# Altium schematic sheet 30to50V-24V_10A_1.SchDoc
size 279 x 215 mm; SheetNumber: 1; SheetTotal: 1
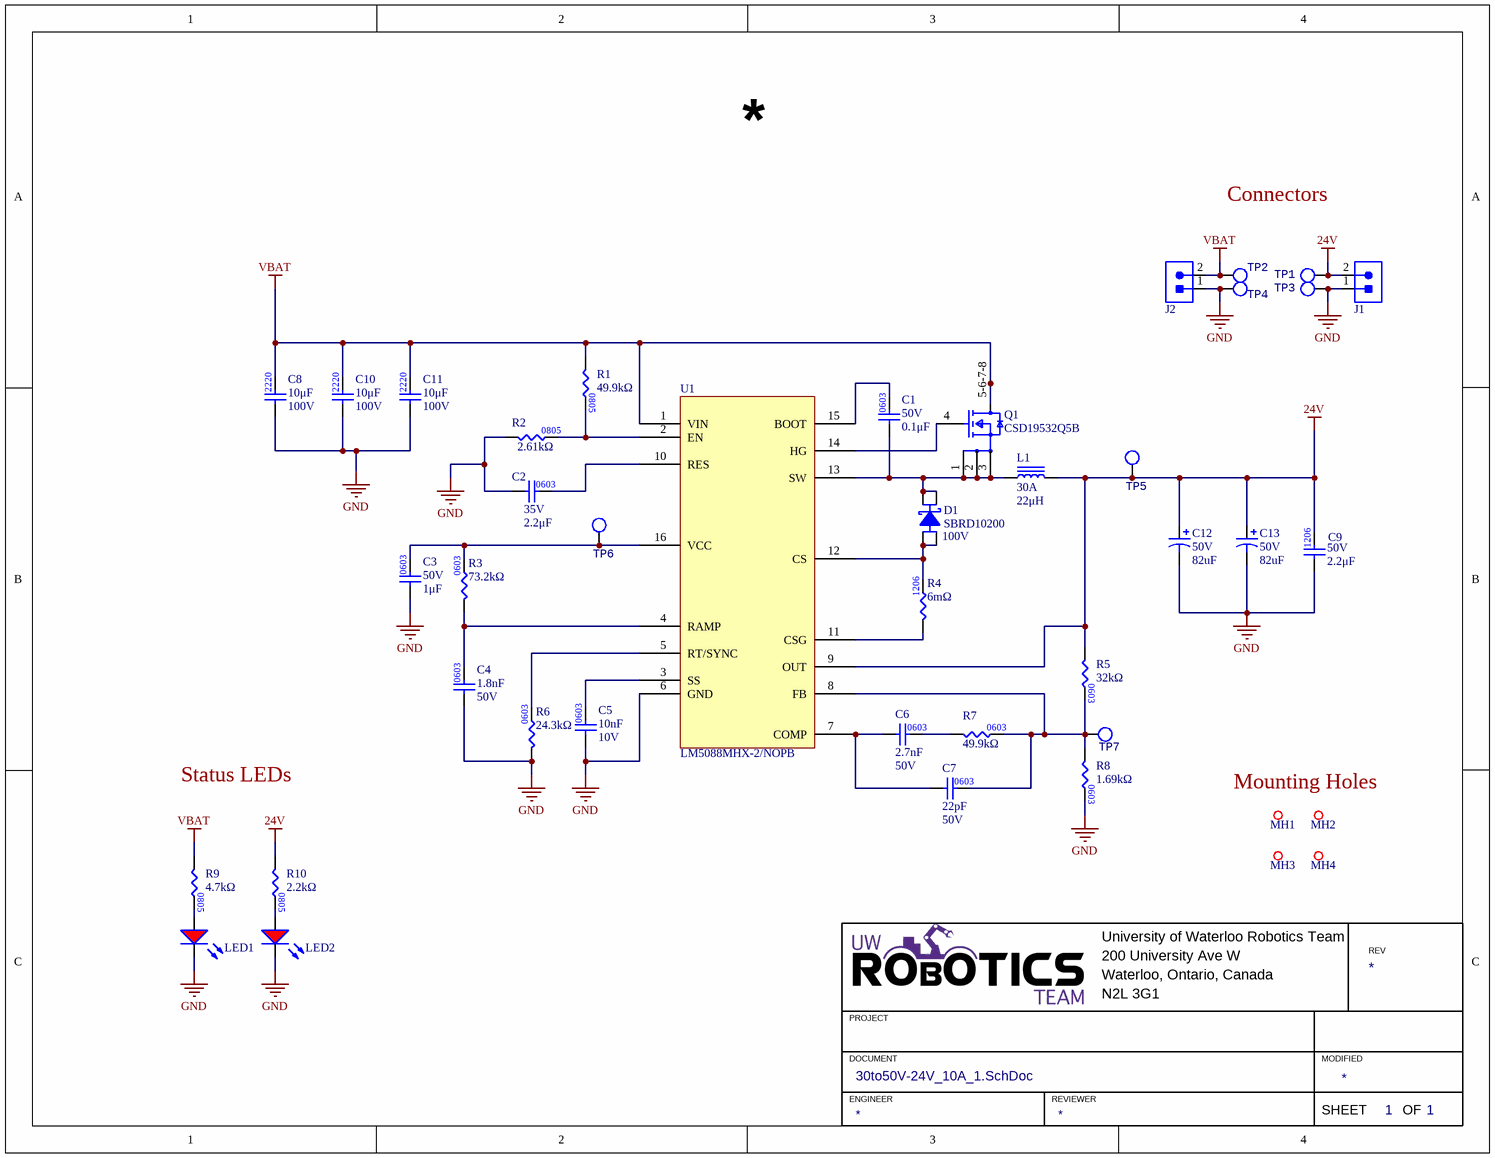
[diagram p0: 30to50V-24V_10A_1.SchDoc]

## Parts
C1  value 0.1μF  Voltage Rating: 50V  [CAP0603]  (hidden comment: CAP_0.1uF_50V_0603)
C2  value 2.2μF  Voltage Rating: 35V  [CAP0603]  (hidden comment: CAP_2.2uF_35V_0603)
C3  value 1μF  Voltage Rating: 50V  [CAP0603]  (hidden comment: CAP_1uF_50V_0603)
C4  value 1.8nF  Voltage Rating: 50V  [CAP0603]  (hidden comment: CAP_1.8nF_50V_0603)
C5  value 10nF  Voltage Rating: 10V  [CAP0603]  (hidden comment: CAP_10nF_25V_0603)
C6  value 2.7nF  Voltage Rating: 50V  [CAP0603]  (hidden comment: CAP_2.7nF_50V_0603)
C7  value 22pF  Voltage Rating: 50V  [CAP0603]  (hidden comment: CAP_22pF_50V_0603)
C8  value 10μF  Voltage Rating: 100V  [C5750X7S2A106M230KB]  (hidden comment: CAP_10uF_50V_2220)
C9  value 2.2μF  Voltage Rating: 50V  [CAP1206]  (hidden comment: CAP_2.2uF_50V_1206)
C10  value 10μF  Voltage Rating: 100V  [C5750X7S2A106M230KB]  (hidden comment: CAP_10uF_50V_2220)
C11  value 10μF  Voltage Rating: 100V  [C5750X7S2A106M230KB]  (hidden comment: CAP_10uF_50V_2220)
C12  Voltage Rating: 50V  Capacitance: 82uF  [RADIAL_CORNELL_D]  (hidden comment: CAP_47uF_100V_ALUM)
C13  Voltage Rating: 50V  Capacitance: 82uF  [RADIAL_CORNELL_D]  (hidden comment: CAP_47uF_100V_ALUM)
D1  Manufacturer Part Number 1: SBRD10200  Vr (Max): 100V  [D-PAK]  (hidden comment: DIO_SCHOTTKY_100V_5.5A)
J1  CON_2POS_SCREW_TERM  [1935161]  (value not drawn)
J2  CON_2POS_SCREW_TERM  [1935161]  (value not drawn)
L1  Current Rating: 30A  Inductance: 22μH  [IND_VISHAY_IHLP6767GZ51]  (hidden comment: IND_22uH_30A)
LED1  LED_RED  [LED_0805_RED]  (value not drawn)
LED2  LED_RED  [LED_0805_RED]  (value not drawn)
MH1  MOUNTING_HOLE_M3_GIMBAL_REV2  [MOUNTING_HOLE_3mm_GIMBAL_REV2]  (value not drawn)  (no BOM)
MH2  MOUNTING_HOLE_M3_GIMBAL_REV2  [MOUNTING_HOLE_3mm_GIMBAL_REV2]  (value not drawn)  (no BOM)
MH3  MOUNTING_HOLE_M3_GIMBAL_REV2  [MOUNTING_HOLE_3mm_GIMBAL_REV2]  (value not drawn)  (no BOM)
MH4  MOUNTING_HOLE_M3_GIMBAL_REV2  [MOUNTING_HOLE_3mm_GIMBAL_REV2]  (value not drawn)  (no BOM)
Q1  CSD19532Q5B  [FP-DNK0008A-MFG]
R1  value 49.9kΩ  [RES0805]  (hidden comment: RES_49.9kΩ_0805_1%)
R2  value 2.61kΩ  [RES0805]  (hidden comment: RES_2.61kΩ_0805_1%)
R3  value 73.2kΩ  [RES0603]  (hidden comment: RES_73.2kΩ_0603_1%)
R4  value 6mΩ  [RES1206]  (hidden comment: RES_0.006Ω_1206_1%)
R5  value 32kΩ  [RES0603]  (hidden comment: RES_32KΩ_0603_0.1%)
R6  value 24.3kΩ  [RES0603]  (hidden comment: RES_24.3kΩ_0603_1%)
R7  value 49.9kΩ  [RES0603]  (hidden comment: RES_49.9kΩ_0603_1%)
R8  value 1.69kΩ  [RES0603]  (hidden comment: RES_1.69kΩ_0603_1%)
R9  value 4.7kΩ  [RES0805]  (hidden comment: RES_4.7kΩ_0805_5%)
R10  value 2.2kΩ  [RES0805]  (hidden comment: RES_2.2kΩ_0805_5%)
TP1  TESTPOINT_LOOP  [TESTPOINT_LOOP]  (value not drawn)
TP2  TESTPOINT_LOOP  [TESTPOINT_LOOP]  (value not drawn)
TP3  TESTPOINT_LOOP  [TESTPOINT_LOOP]  (value not drawn)
TP4  TESTPOINT_LOOP  [TESTPOINT_LOOP]  (value not drawn)
TP5  TESTPOINT_LOOP  [TESTPOINT_LOOP]  (value not drawn)
TP6  TESTPOINT_LOOP  [TESTPOINT_LOOP]  (value not drawn)
TP7  TESTPOINT_LOOP  [TESTPOINT_LOOP]  (value not drawn)
U1  LM5088  (value not drawn)

## Nets
24V: C9.2 C12.1 C13.1 J1.2 L1.2 R5.1 R10.1 TP1.1 TP5.1 U1.9(OUT)
GND: C2.1 C3.1 C4.1 C5.1 C8.1 C9.1 C10.1 C11.1 C12.2 C13.2 J1.1 J2.1 LED1.2(K) LED2.2(K) R2.1 R6.1 R8.2 TP3.1 TP4.1 U1.6(GND)
VBAT: C8.2 C10.2 C11.2 J2.2 Q1.5-6-7-8(D) R1.1 R9.1 TP2.1 U1.1(VIN)
NetC1_1: C1.1 D1.2(Cathode) D1.4(Cathode) L1.1 Q1.1(S) Q1.2(S) Q1.3(S) U1.13(SW)
NetC1_2: C1.2 U1.15(BOOT)
NetC2_2: C2.2 U1.10(RES)
NetC3_2: C3.2 R3.2 TP6.1 U1.16(VCC)
NetC4_2: C4.2 R3.1 U1.4(RAMP)
NetC5_2: C5.2 U1.3(SS)
NetC6_1: C6.1 C7.1 U1.7(COMP)
NetC6_2: C6.2 R7.1
NetC7_2: C7.2 R5.2 R7.2 R8.1 TP7.1 U1.8(FB)
NetD1_1: D1.1(Anode) D1.3(Anode) R4.2 U1.12(CS)
NetLED1_1: LED1.1(A) R9.2
NetLED2_1: LED2.1(A) R10.2
NetQ1_4: Q1.4(G) U1.14(HG)
NetR1_2: R1.2 R2.2 U1.2(EN)
NetR4_1: R4.1 U1.11(CSG)
NetR6_2: R6.2 U1.5(RT/SYNC)

## Notes on the sheet
- Connectors
- Status LEDs
- Mounting Holes
- R = V/I
  R = (50V)/(10mA)
  R = 5kΩ
  Closest standard value: 4.7kΩ
- R = V/I
  R = (24)/(10mA)
  R = 2.4kΩ
  Closest standard value: 2.2kΩ
- University of Waterloo Robotics Team
- 200 University Ave W
- REV
- PROJECT
- Waterloo, Ontario, Canada
- N2L 3G1
- DOCUMENT
- ENGINEER
- REVIEWER
- MODIFIED
- SHEET
- OF
- (in symbol CAP_1.8nF_50V_0603) 0603
- (in symbol CAP_1uF_50V_0603) 0603
- (in symbol CAP_2.2uF_35V_0603) 0603
- (in symbol CAP_2.2uF_50V_1206) 1206
- (in symbol CAP_2.7nF_50V_0603) 0603
- (in symbol CAP_10nF_25V_0603) 0603
- (in symbol CAP_10uF_50V_2220) 2220
- (in symbol CAP_22pF_50V_0603) 0603
- (in symbol RES_1.69kΩ_0603_1%) 0603
- (in symbol RES_49.9kΩ_0603_1%) 0603

## Library data of the parts
C1 = CAP_0.1uF_50V_0603: CAP CER 0.1UF 50V X7R 0603; Manufacturer Part Number 1: CC0603KRX7R9BB104; Manufacturer 1: Yageo; Package/Footprint: 0603; Supplier Part Number 1: 311-1344-1-ND; Supplier 1: Digi-Key; Mounting Type: SMD; Dielectric: X7R
C2 = CAP_2.2uF_35V_0603: CAP CER 2.2UF 35V X5R 0603; Manufacturer Part Number 1: C1608X5R1V225K080AC; Manufacturer 1: TDK Corporation; Dielectric: 5; Supplier Part Number 1: 445-8025-1-ND; Supplier 1: Digi-Key
C3 = CAP_1uF_50V_0603: CAP CER 1UF 50V X6S 0603; Manufacturer Part Number 1: C1608X6S1H105K080AC; Manufacturer 1: TDK Corporation; Supplier Part Number 1: 445-7424-1-ND; Supplier 1: Digi-Key; Dielectric: X6S
C4 = CAP_1.8nF_50V_0603: CAP CER 1800PF 50V C0G/NP0 0603; Manufacturer Part Number 1: GRM1885C1H182JA01J; Manufacturer 1: Murata Electronics; Dielectric: C0G; Supplier Part Number 1: 490-6380-1-ND; Supplier 1: Digi-Key
C5 = CAP_10nF_25V_0603: CAP CER 10000PF 25V C0G 0603; Manufacturer Part Number 1: C1608C0G1E103J080AA; Manufacturer 1: Yageo; Supplier Part Number 1: 445-2664-1-ND; Supplier 1: Digi-Key; Dielectric: C0G
C6 = CAP_2.7nF_50V_0603: CAP CER 2700PF 50V X7R 0603; Manufacturer Part Number 1: GRM1885C1H272JA01D; Manufacturer 1: Murata Electronics; Dielectric: C0G; Supplier Part Number 1: 490-3283-1-ND; Supplier 1: Digi-Key
C7 = CAP_22pF_50V_0603: CAP CER 22PF 50V C0G/NPO 0603; Manufacturer Part Number 1: CC0603JRNPO9BN220; Manufacturer 1: Yageo; Dielectric: C0G; Supplier Part Number 1: 311-1062-1-ND; Supplier 1: Digi-Key
C8 C10 C11 = CAP_10uF_50V_2220: CAP CER 10UF 100V X7S 2220; Manufacturer 1: TDK Corporation; Manufacturer Part Number 1: C5750X7S2A106K230KB; Dielectric: X7S; Supplier 1: Digi-Key; Supplier Part Number 1: 445-13408-1-ND
C9 = CAP_2.2uF_50V_1206: CAP CER 2.2UF 50V X7R 1206; Manufacturer 1: Murata Electronics; Manufacturer Part Number 1: GCM31CR71H225KA55L; Supplier Part Number 1: 490-4796-1-ND; Supplier 1: Digi-Key; Dielectric: X7R
C12 C13 = CAP_47uF_100V_ALUM: Aluminum Electrolytic Capacitor, Polarized, Aluminum (wet), 100V, 20% +Tol, 20% -Tol, 47uF, Surface Mount, 5454; Manufacturer: Nichicon; Manufacturer Part Number: UCD2A470MNQ1MS; Dielectric Material: Aluminium; Leakage Current: 47uA; Ripple Current: 250mA; Tan Delta: 0.07; ComponentLink1URL: https://datasheet.ciiva.com:443/pdfs/VipMasterIC/IC/NICH/NICH-S-A0003527725/NICH-S-A0003527725-1.pdf?src-supplier=IHS+Markit; ComponentLink1Description: https://datasheet.ciiva.com:443/pdfs/VipMasterIC/IC/NICH/NICH-S-A0003527725/NICH-S-A0003527725-1.pdf?src-supplier=IHS+Markit; ComponentLink2URL: https://datasheet.ciiva.com/11776/0900766b80ebdadd-11776792.pdf?src-supplier=RSComponents; ComponentLink2Description: https://datasheet.ciiva.com/11776/0900766b80ebdadd-11776792.pdf?src-supplier=RSComponents; ComponentLink3URL: https://datasheet.ciiva.com/30526/getdatasheetpartid-513218-30526979.pdf?src-supplier=Verical; ComponentLink3Description: https://datasheet.ciiva.com/30526/getdatasheetpartid-513218-30526979.pdf?src-supplier=Verical; ComponentLink4URL: https://datasheet.ciiva.com/16389/e-cd-16389182.pdf?src-supplier=Future+Electronics; ComponentLink4Description: https://datasheet.ciiva.com/16389/e-cd-16389182.pdf?src-supplier=Future+Electronics; ComponentLink5URL: https://datasheet.ciiva.com/17523/e-cd-17523974.pdf?src-supplier=Avnet+Europe; ComponentLink5Description: https://datasheet.ciiva.com/17523/e-cd-17523974.pdf?src-supplier=Avnet+Europe; ComponentLink6URL: https://datasheet.ciiva.com/6326/e-cd-6326630.pdf?src-supplier=Digi-Key; ComponentLink6Description: https://datasheet.ciiva.com/6326/e-cd-6326630.pdf?src-supplier=Digi-Key; ComponentLink7URL: https://datasheet.ciiva.com/6326/e-cd-6326632.pdf?src-supplier=Digi-Key; ComponentLink7Description: https://datasheet.ciiva.com/6326/e-cd-6326632.pdf?src-supplier=Digi-Key; ComponentLink8URL: https://datasheet.ciiva.com/6326/e-cd-6326634.pdf?src-supplier=Digi-Key; ComponentLink8Description: https://datasheet.ciiva.com/6326/e-cd-6326634.pdf?src-supplier=Digi-Key; Supplier 1: Digi-Key; RoHS: Yes; Category: Aluminum Electrolytic Capacitors; Stock 1: 515; Pricing 1: 1=2.15000, 10=1.69800, 50=1.47140, 100=1.27330 (USD); Mount: Surface Mount; Number of Pins: 2; Package Shape: Cylindrical; Size Code: 7575; Terminal Finish: Copper; Min Operating Temperature: -55°C; Max Operating Temperature: 105°C; JESD-609 Code: e3; Polarity: Polarized; Capacitor Type: Aluminium; Negative Tolerance: 20%; Package Style: SMTMeter; Packaging: Tape and Reel; Positive Tolerance: 20%; Rated DC Voltage (URdc): 100V; Termination: Flat; Length: 14.6mm; Width: 13.6mm; Height: 13.5mm; REACH SVHC: Yes; RoHS Compliant: Yes; Supplier Part Number 1: 493-6201-1-ND
D1 = DIO_SCHOTTKY_200V_10A: DIODE SCHOTTKY 200V 10A DPAK; Manufacturer 1: SMC Diode Solutions; Package/Footprint: TO-252-3, DPak (2 Leads + Tab), SC-63; Supplier 1: Digi-Key; Supplier Part Number 1: 1655-SBRD10200CT-ND; Mounting Type: SMD
J1 J2 = CON_2POS_SCREW_TERM: TERM BLK 2POS SIDE ENTRY 5MM; Manufacturer 1: Phoenix Contact; Package/Footprint: SMD; Supplier 1: Digi-Key; Mounting Type: TH; Supplier Part Number 1: 277-1667-ND; Manufacturer Part Number 1: 1935161
L1 = IND_22uH_30A: FIXED IND 22UH 30A 2.4 MOHM SMD; Manufacturer 1: Würth Elektronik; Manufacturer Part Number 1: 7443642200; DC Resistance (DCR): 2.4mR; Inductance Tolerance: 15%; Saturation Current: 30A; Supplier 1: Digi-Key; Supplier Part Number 1: 732-5628-ND; Mounting Type: SMD
LED1 LED2 = LED_RED: LED RED DIFFUSED 0805 SMD; Manufacturer 1: OSRAM; Manufacturer Part Number 1: LS R976-NR-1; Package/Footprint: 0805; Forward Voltage Drop: 2V; Supplier Part Number 1: 475-1278-1-ND; Supplier 1: Digi-Key; Mounting Type: SMD
MH1-MH4 = MOUNTING_HOLE_M3_GIMBAL_REV2: MOUNTING_HOLE_M3 Gimbal Rev2
Q1 = CMP-04962-000007-1: MOSFET N-CH 100V 100A 8SON; Manufacturer: Texas Instruments; Depletion Mode: False; Number Of Channels: 1; Gate To Source Voltage: 20V; Reverse Recovery Time: 80ns; Input Capacitace At Vds: 3700pF @ 50V; Max Forward Diode Voltage: 1V; Turn Off Delay Time: 22ns; Drain To Source Resistance: 4.6mΩ; Threshold Vgs Max: 3.2V; Max Junction Temp: +150°C; Turn On Delay Time: 7ns; Pulse Drain Current: 400A; Rthja Max: 50°C/W; Typ Forward Diode Voltage: 0.8V; Reverse Recovery Charge: 249nC; Threshold Vgs Min: 2.2V; Gate Charge At Vgs: 48nC @ 10V; Power Dissipation: 3.1W; Transconductance: 84S; Temperature Range Low: -55°C; Automotive: No; RoHS: TRUE; Temperature: -55°C to +150°C; Device Class L3: MOSFETs; Continuous Drain Current: 100A; Number Of N Channels: 1; Height: 1.05mm; Mouser Description: MOSFET 100V 4.0 mOhm N-Ch NexFET Power MOSFET; Drain To Source Voltage: 100V; Temperature Range High: +150°C; Manufacturer Part Number: CSD19532Q5B; Octopart: https://octopart.com/csd19532q5b-texas+instruments-32890191; ComponentLink2URL: http://www.ti.com/lit/ds/symlink/csd19532q5b.pdf; Lead Free: Yes; Drain To Source Breakdown Voltage: 100V; Device Class L1: Discrete Semiconductors; Device Class L2: Transistors; Package: DNK0008A; Digikey Description: MOSFET N-CH 100V 100A 8SON; Category: Trans; ComponentLink2Description: Datasheet
R1 = RES_49.9kΩ_0805_1%: RES 49.9K OHM 1% 1/8W 0805; Manufacturer 1: Vishay Dale; Manufacturer Part Number 1: TNPW080549K9BEEN; Package/Footprint: 0805; Supplier 1: Digi-Key; Mounting Type: SMD; Supplier Part Number 1: 541-3802-1-ND; LCSC Part #: C17719
R2 = RES_2.61kΩ_0805_1%: RES 2.61K OHM 1% 1/8W 0805; Manufacturer 1: Vishay Dale; Manufacturer Part Number 1: RC0805FR-072K61L; Package/Footprint: 0805; Supplier 1: Digi-Key; Mounting Type: SMD; Supplier Part Number 1: 311-2.61KCRCT-ND
R3 = RES_73.2kΩ_0603_1%: RES 73.2K OHM 1% 1/10W 0603; Manufacturer 1: YAGEO; Manufacturer Part Number 1: RC0603FR-0773K2L; Power: 0.1W; Supplier Part Number 1: 311-73.2KHRCT-ND; Supplier 1: Digi-Key; Package: 0603; Tolerance: 1%
R4 = RES_0.006Ω_1206_1%: RES 0.006 OHM 1% 1W 1206; Manufacturer 1: Rohm Semiconductor; Package/Footprint: 1206; Manufacturer Part Number 1: Rohm Semiconductor; Mounting Type: SMD; Supplier 1: Digi-Key; Supplier Part Number 1: RHM.006ALCT-ND
R5 = RES_32KΩ_0603_0.1%: RES SMD 32K OHM 0.1% 1/10W 0603; Manufacturer 1: Yageo; Manufacturer Part Number 1: RT0603BRD0732KL; Supplier Part Number 1: 13-RT0603BRD0732KLCT-ND; Supplier 1: Digi-Key; Mounting Type: SMD; Package: 0603
R6 = RES_24.3kΩ_0603_1%: RES 24.3K OHM 1% 1/10W 0603; Manufacturer 1: YAGEO; Manufacturer Part Number 1: RC0603FR-0724K3L; Power: 0.1W; Supplier Part Number 1: 311-24.3KHRCT-ND; Supplier 1: Digi-Key; Package: 0603; Tolerance: 1%
R7 = RES_49.9kΩ_0603_1%: RES 49.9K OHM 1% 1/10W 0603; Manufacturer Part Number 1: RK73H1JTTD4992F; Manufacturer 1: KOA Speer Electronics, Inc.; Supplier 1: Digi-Key; Supplier Part Number 1: 2019-RK73H1JTTD4992FCT-ND; Mounting Type: SMD
R8 = RES_1.69kΩ_0603_1%: RES 1.69K OHM 1% 1/10W 0603; Manufacturer 1: Yageo; Manufacturer Part Number 1: RC0603FR-071K69L; Supplier 1: Digi-Key; Supplier Part Number 1: 311-1.69KHRCT-ND
R9 = RES_4.7kΩ_0805_5%: RES 4.7K OHM 5% 1/8W 0805; Manufacturer 1: Yageo; Manufacturer Part Number 1: RC0805JR-074K7L; Supplier 1: Digi-Key; Supplier Part Number 1: 311-4.7KARCT-ND; Mounting Type: SMD; LCSC Part #: C17673; Package: 0805
R10 = RES_2.2kΩ_0805_5%: RES 2.2K OHM 5% 1/8W 0805; Manufacturer 1: Vishay Dale; Manufacturer Part Number 1: CRCW08052K20JNEAC; Supplier 1: Digi-Key; Supplier Part Number 1: 541-4169-1-ND; Tolerance: 5%; Package: 0805
TP1-TP7 = TESTPOINT_LOOP: TESTPOINT THRUHOLE; Manufacturer 1: Keystone Electronics; Manufacturer Part Number 1: 5002; Package/Footprint: TH; Supplier Part Number 1: 36-5002-ND; Supplier 1: Digi-Key; Mounting Type: TH
U1 = LM5088MHX-2/NOPB: IC REG CTRLR BUCK 16HTSSOP; Manufacturer 1: Texas Instruments; Supply Voltage: 4.5V - 75V; Switching Frequency: 50kHz - 1MHz; Supplier 1: Digi-Key; Supplier Part Number 1: 296-35302-1-ND; Package: 16-HTSSOP; Manufacturer Part Number 1: LM5088MHX-2/NOPB